# Altium schematic sheet Connectors.SchDoc
size A4; SheetNumber: 1; SheetTotal: 1
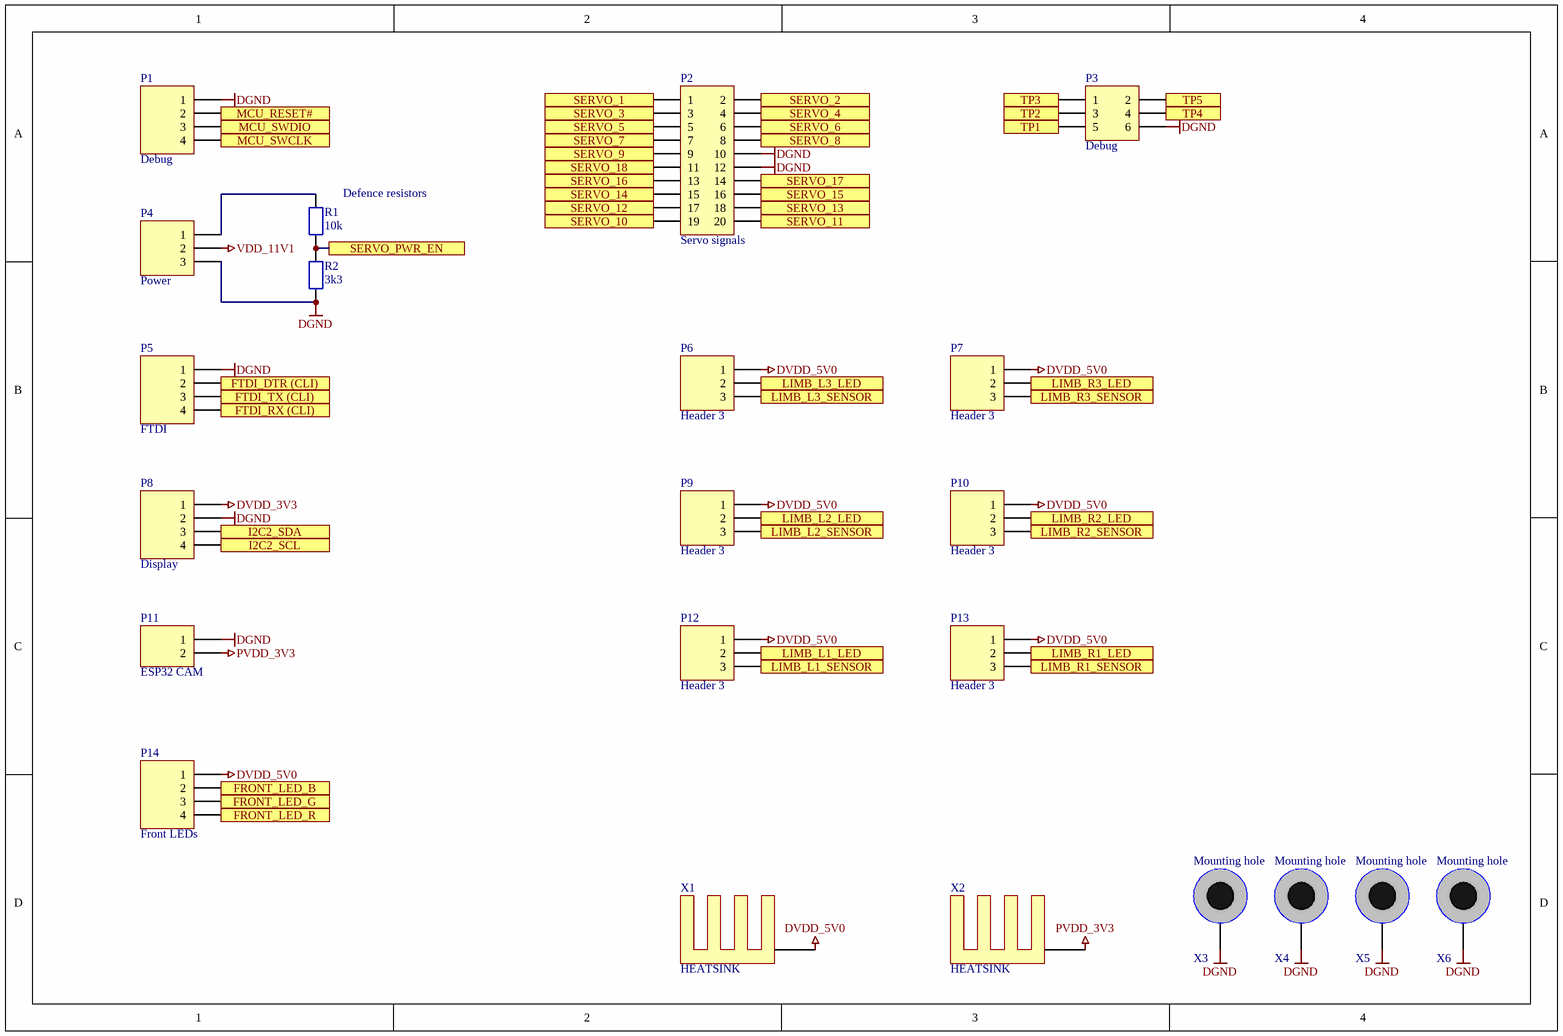
[diagram p0: Connectors.SchDoc]

## Parts
P1  Debug  [PLS-4 2.54]
P2  Servo signals  [IDC-20 OUTLINE]
P3  Debug  [PLD-3 2.54]
P4  Power  [PLS-3 2.54 OUTLINE]
P5  FTDI  [PLS-4R 2.54]
P6  Header 3  [PLS-3R 2.54]
P7  Header 3  [PLS-3R 2.54]
P8  Display  [PLS-4R 2.54]
P9  Header 3  [PLS-3R 2.54]
P10  Header 3  [PLS-3R 2.54]
P11  ESP32 CAM  [PLS-2 2.54 OUTLINE]
P12  Header 3  [PLS-3R 2.54]
P13  Header 3  [PLS-3R 2.54]
P14  Front LEDs  [PLS-4R 2.54]
R1  10k  [R_0603/1608]
R2  3k3  [R_0603/1608]
X1  HEATSINK  [HEATSINK 20x14x6]
X2  HEATSINK  [HEATSINK 20x14x6]
X3  Mounting hole  [HOLE_M2_D4.0/2.5]  (no BOM)
X4  Mounting hole  [HOLE_M2_D4.0/2.5]  (no BOM)
X5  Mounting hole  [HOLE_M2_D4.0/2.5]  (no BOM)
X6  Mounting hole  [HOLE_M2_D4.0/2.5]  (no BOM)

## Ports
FRONT_LED_B, FRONT_LED_G, FRONT_LED_R, FTDI_DTR (CLI), FTDI_RX (CLI), FTDI_TX (CLI), I2C2_SCL, I2C2_SDA, LIMB_L1_LED, LIMB_L1_SENSOR, LIMB_L2_LED, LIMB_L2_SENSOR, LIMB_L3_LED, LIMB_L3_SENSOR, LIMB_R1_LED, LIMB_R1_SENSOR, LIMB_R2_LED, LIMB_R2_SENSOR, LIMB_R3_LED, LIMB_R3_SENSOR, MCU_RESET#, MCU_SWCLK, MCU_SWDIO, SERVO_1, SERVO_2, SERVO_3, SERVO_4, SERVO_5, SERVO_6, SERVO_7, SERVO_8, SERVO_9, SERVO_10, SERVO_11, SERVO_12, SERVO_13, SERVO_14, SERVO_15, SERVO_16, SERVO_17, SERVO_18, SERVO_PWR_EN, TP1, TP2, TP3, TP4, TP5

## Nets
DGND: P1.1 P2.10 P2.12 P3.6 P4.3 P5.1 P8.2 P11.1 R2.1 X3.1 X4.1 X5.1 X6.1
DVDD_3V3: P8.1
DVDD_5V0: P6.1 P7.1 P9.1 P10.1 P12.1 P13.1 P14.1 X1.1
PVDD_3V3: P11.2 X2.1
VDD_11V1: P4.2
FRONT_LED_B: P14.2 ; port FRONT_LED_B
FRONT_LED_G: P14.3 ; port FRONT_LED_G
FRONT_LED_R: P14.4 ; port FRONT_LED_R
FTDI_DTR (CLI): P5.2 ; port FTDI_DTR (CLI)
FTDI_RX (CLI): P5.4 ; port FTDI_RX (CLI)
FTDI_TX (CLI): P5.3 ; port FTDI_TX (CLI)
I2C2_SCL: P8.4 ; port I2C2_SCL
I2C2_SDA: P8.3 ; port I2C2_SDA
LIMB_L1_LED: P12.2 ; port LIMB_L1_LED
LIMB_L1_SENSOR: P12.3 ; port LIMB_L1_SENSOR
LIMB_L2_LED: P9.2 ; port LIMB_L2_LED
LIMB_L2_SENSOR: P9.3 ; port LIMB_L2_SENSOR
LIMB_L3_LED: P6.2 ; port LIMB_L3_LED
LIMB_L3_SENSOR: P6.3 ; port LIMB_L3_SENSOR
LIMB_R1_LED: P13.2 ; port LIMB_R1_LED
LIMB_R1_SENSOR: P13.3 ; port LIMB_R1_SENSOR
LIMB_R2_LED: P10.2 ; port LIMB_R2_LED
LIMB_R2_SENSOR: P10.3 ; port LIMB_R2_SENSOR
LIMB_R3_LED: P7.2 ; port LIMB_R3_LED
LIMB_R3_SENSOR: P7.3 ; port LIMB_R3_SENSOR
MCU_RESET#: P1.2 ; port MCU_RESET#
MCU_SWCLK: P1.4 ; port MCU_SWCLK
MCU_SWDIO: P1.3 ; port MCU_SWDIO
SERVO_1: P2.1 ; port SERVO_1
SERVO_2: P2.2 ; port SERVO_2
SERVO_3: P2.3 ; port SERVO_3
SERVO_4: P2.4 ; port SERVO_4
SERVO_5: P2.5 ; port SERVO_5
SERVO_6: P2.6 ; port SERVO_6
SERVO_7: P2.7 ; port SERVO_7
SERVO_8: P2.8 ; port SERVO_8
SERVO_9: P2.9 ; port SERVO_9
SERVO_10: P2.19 ; port SERVO_10
SERVO_11: P2.20 ; port SERVO_11
SERVO_12: P2.17 ; port SERVO_12
SERVO_13: P2.18 ; port SERVO_13
SERVO_14: P2.15 ; port SERVO_14
SERVO_15: P2.16 ; port SERVO_15
SERVO_16: P2.13 ; port SERVO_16
SERVO_17: P2.14 ; port SERVO_17
SERVO_18: P2.11 ; port SERVO_18
SERVO_PWR_EN: R1.1 R2.2 ; port SERVO_PWR_EN
TP1: P3.5 ; port TP1
TP2: P3.3 ; port TP2
TP3: P3.1 ; port TP3
TP4: P3.4 ; port TP4
TP5: P3.2 ; port TP5
NetP4_1: P4.1 R1.2

## Notes on the sheet
- (near R1) Defence resistors

## Library data of the parts
P1 P5 P8 P14 = Header 4: Header, 4-Pin; LatestRevisionDate: 17-Jul-2002; LatestRevisionNote: Re-released for DXP Platform.; Publisher: Altium Limited
P2 = Header 2x10: Header, 20-Pin; LatestRevisionDate: 17-Jul-2002; LatestRevisionNote: Re-released for DXP Platform.; Publisher: Altium Limited
P3 = Header 2x3: Header, 2x3-Pin; LatestRevisionDate: 17-Jul-2002; LatestRevisionNote: Re-released for DXP Platform.; Publisher: Altium Limited
P4 P6 P7 P9 P10 P12 P13 = Header 3: Header, 3-Pin; LatestRevisionDate: 17-Jul-2002; LatestRevisionNote: Re-released for DXP Platform.; Publisher: Altium Limited
P11 = Header 2: Header, 2-Pin; LatestRevisionDate: 17-Jul-2002; LatestRevisionNote: Re-released for DXP Platform.; Publisher: Altium Limited
R1 R2 = Resistor
X3-X6 = Mounting hole: Hole for screw M3, outline D6